# Altium schematic sheet Sh_Controls.SchDoc
size A4
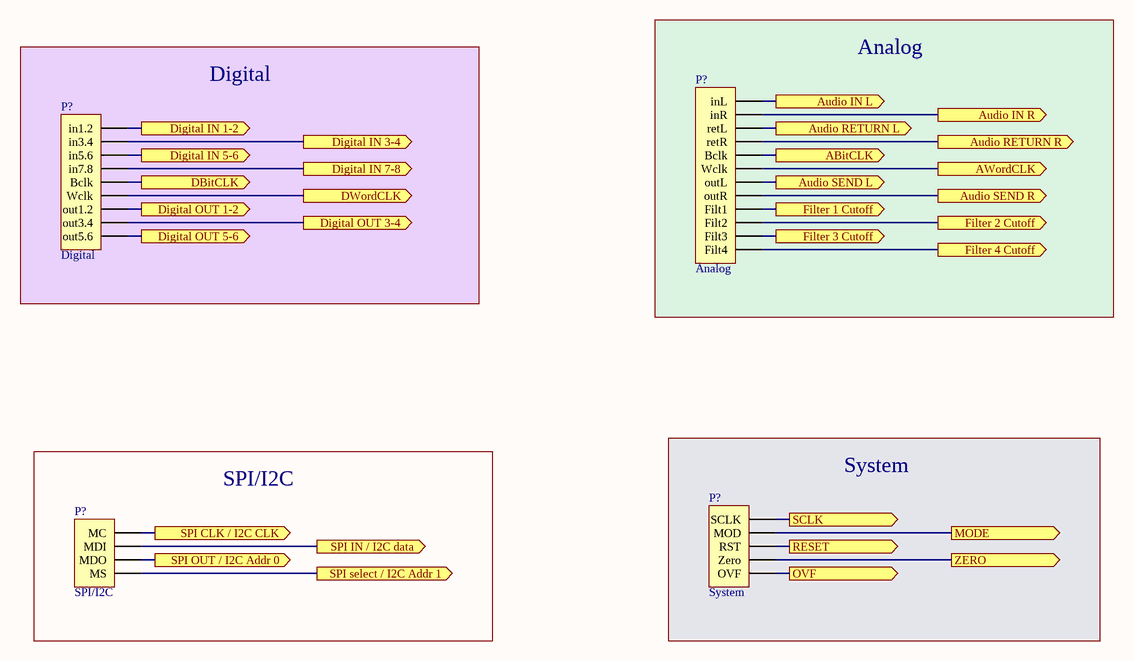
[diagram p0: Sh_Controls.SchDoc]

## Parts
(Parts that share a designator on the sheet are numbered #1, #2 ... from top to bottom, then left to right.)
P?#1  Analog  [HDR1X12]
P?#2  Digital  [HDR1X9]
P?#3  SPI/I2C  [HDR1X4]
P?#4  System  [HDR1X5]

## Blocks framed on the sheet
Digital: P?#2
Analog: P?#1
SPI/I2C: P?#3
System: P?#4

## Ports
ABitCLK (out), Audio IN L (out), Audio IN R (out), Audio RETURN L (out), Audio RETURN R (out), Audio SEND L (out), Audio SEND R (out), AWordCLK (out), DBitCLK (out), Digital IN 1-2 (out), Digital IN 3-4 (out), Digital IN 5-6 (out), Digital IN 7-8 (out), Digital OUT 1-2 (out), Digital OUT 3-4 (out), Digital OUT 5-6 (out), DWordCLK (out), Filter 1 Cutoff (out), Filter 2 Cutoff (out), Filter 3 Cutoff (out), Filter 4 Cutoff (out), MODE (out), OVF (out), RESET (out), SCLK (out), SPI CLK / I2C CLK (out), SPI IN / I2C data (out), SPI OUT / I2C Addr 0 (out), SPI select / I2C Addr 1 (out), ZERO (out)

## Nets
ABitCLK: P?#1.5(Bclk) ; port ABitCLK
Audio IN L: P?#1.1(inL) ; port Audio IN L
Audio IN R: P?#1.2(inR) ; port Audio IN R
Audio RETURN L: P?#1.3(retL) ; port Audio RETURN L
Audio RETURN R: P?#1.4(retR) ; port Audio RETURN R
Audio SEND L: P?#1.7(outL) ; port Audio SEND L
Audio SEND R: P?#1.8(outR) ; port Audio SEND R
AWordCLK: P?#1.6(Wclk) ; port AWordCLK
DBitCLK: P?#2.5(Bclk) ; port DBitCLK
Digital IN 1-2: P?#2.1(in1.2) ; port Digital IN 1-2
Digital IN 3-4: P?#2.2(in3.4) ; port Digital IN 3-4
Digital IN 5-6: P?#2.3(in5.6) ; port Digital IN 5-6
Digital IN 7-8: P?#2.4(in7.8) ; port Digital IN 7-8
Digital OUT 1-2: P?#2.7(out1.2) ; port Digital OUT 1-2
Digital OUT 3-4: P?#2.8(out3.4) ; port Digital OUT 3-4
Digital OUT 5-6: P?#2.9(out5.6) ; port Digital OUT 5-6
DWordCLK: P?#2.6(Wclk) ; port DWordCLK
Filter 1 Cutoff: P?#1.9(Filt1) ; port Filter 1 Cutoff
Filter 2 Cutoff: P?#1.10(Filt2) ; port Filter 2 Cutoff
Filter 3 Cutoff: P?#1.11(Filt3) ; port Filter 3 Cutoff
Filter 4 Cutoff: P?#1.12(Filt4) ; port Filter 4 Cutoff
MODE: P?#4.4(MOD) ; port MODE
OVF: P?#4.1(OVF) ; port OVF
RESET: P?#4.3(RST) ; port RESET
SCLK: P?#4.5(SCLK) ; port SCLK
SPI CLK / I2C CLK: P?#3.4(MC) ; port SPI CLK / I2C CLK
SPI IN / I2C data: P?#3.3(MDI) ; port SPI IN / I2C data
SPI OUT / I2C Addr 0: P?#3.2(MDO) ; port SPI OUT / I2C Addr 0
SPI select / I2C Addr 1: P?#3.1(MS) ; port SPI select / I2C Addr 1
ZERO: P?#4.2(Zero) ; port ZERO

## Library data of the parts
P?#1 = Header 12: Header, 12-Pin; LatestRevisionDate: 17-Jul-2002; LatestRevisionNote: Re-released for DXP Platform.; Publisher: Altium Limited
P?#2 = Header 9: Header, 9-Pin; LatestRevisionDate: 17-Jul-2002; LatestRevisionNote: Re-released for DXP Platform.; Publisher: Altium Limited
P?#3 = Header 4: Header, 4-Pin; LatestRevisionDate: 17-Jul-2002; LatestRevisionNote: Re-released for DXP Platform.; Publisher: Altium Limited
P?#4 = Header 5: Header, 5-Pin; LatestRevisionDate: 17-Jul-2002; LatestRevisionNote: Re-released for DXP Platform.; Publisher: Altium Limited